# Altium schematic sheet logic.SchDoc
size A4; SheetNumber: 4; SheetTotal: 6
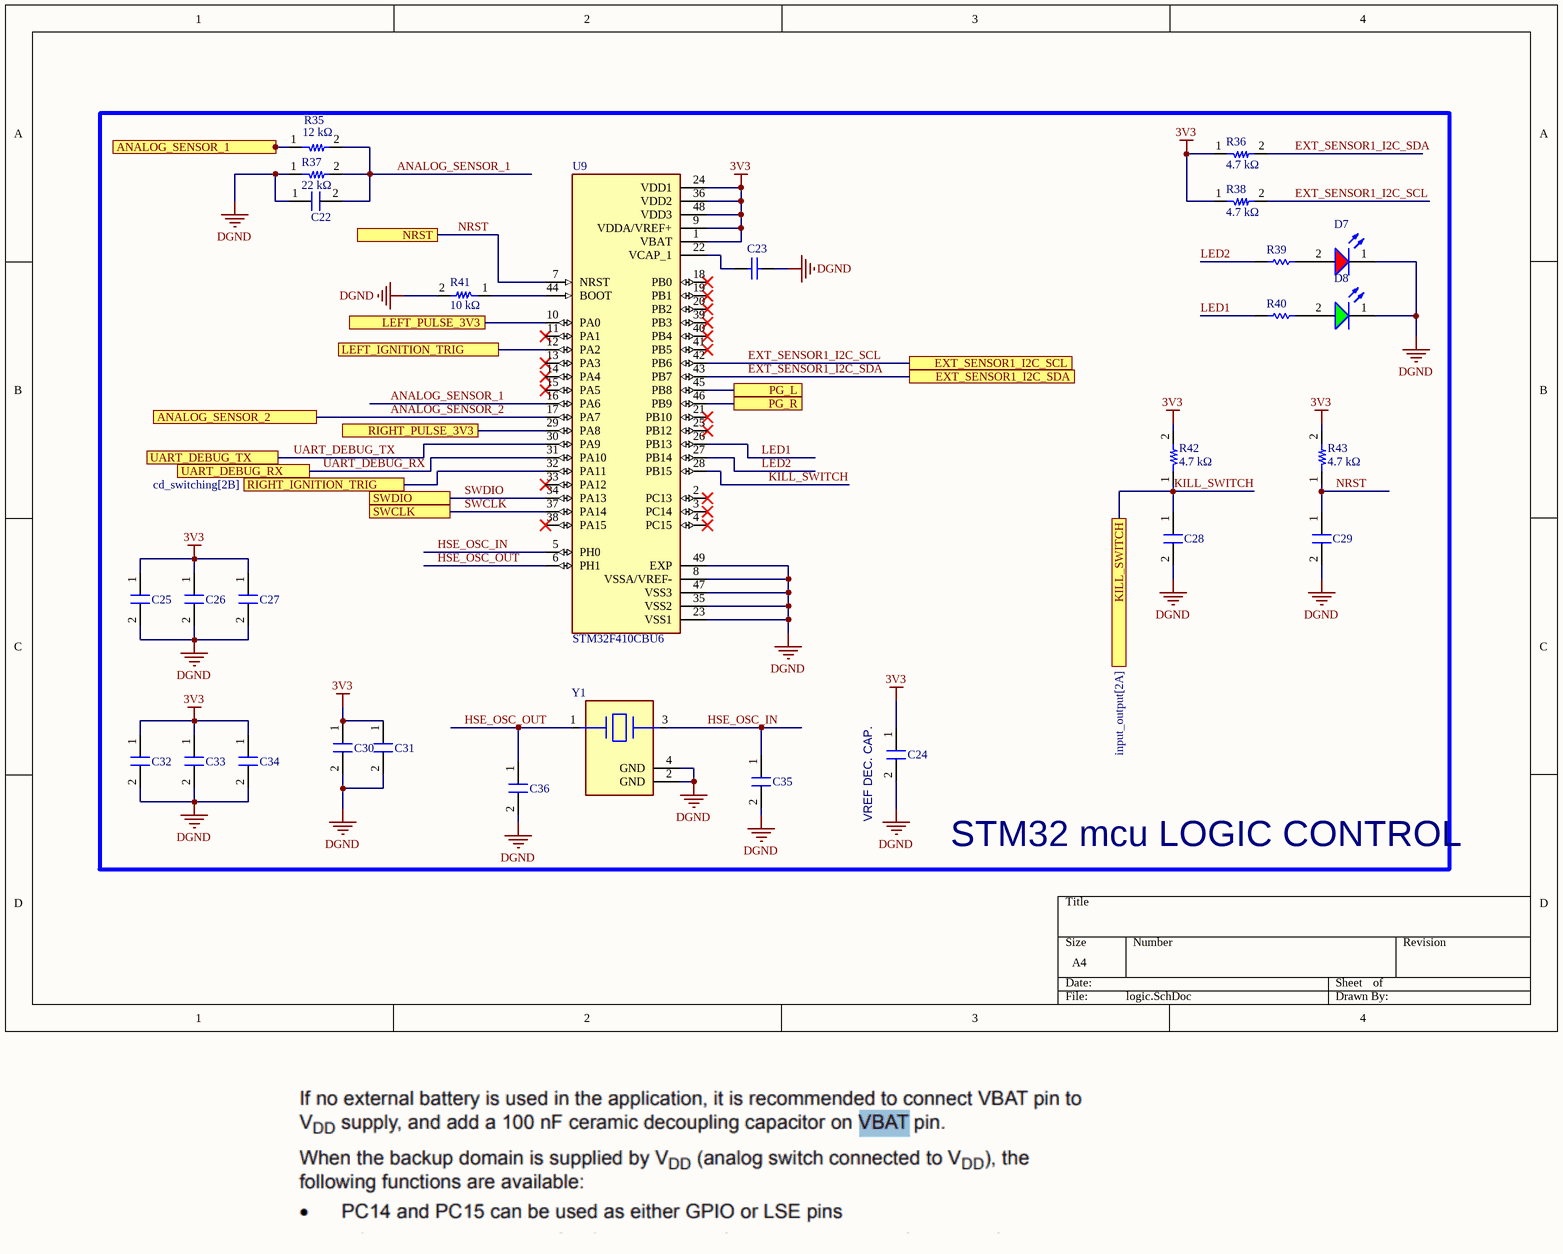
[diagram p0: logic.SchDoc]

## Parts
C22  Capacitor_0402  [0402_fp]  (value not drawn)
C23  0603ZD475MAT2A  [CAPC1608X90X35NL15T15]  (value not drawn)
C24  Capacitor_0402  [0402_fp]  (value not drawn)
C25  Capacitor_0402  [0402_fp]  (value not drawn)
C26  Capacitor_0402  [0402_fp]  (value not drawn)
C27  Capacitor_0402  [0402_fp]  (value not drawn)
C28  Capacitor_0402  [0402_fp]  (value not drawn)
C29  Capacitor_0402  [0402_fp]  (value not drawn)
C30  Capacitor_0402  [0402_fp]  (value not drawn)
C31  Capacitor_0402  [0402_fp]  (value not drawn)
C32  Capacitor_0402  [0402_fp]  (value not drawn)
C33  Capacitor_0402  [0402_fp]  (value not drawn)
C34  Capacitor_0402  [0402_fp]  (value not drawn)
C35  Capacitor_0603  [0603_FP]  (value not drawn)
C36  Capacitor_0603  [0603_FP]  (value not drawn)
D7  150080RS75000  [WL-SMCW_0805_150080xx75000]  (value not drawn)
D8  150080GS75000  [WL-SMCW_0805_150080xx75000]  (value not drawn)
R35  value 12 kΩ  [0402_fp]  (hidden comment: Resistor_0402)
R36  value 4.7 kΩ  [0402_fp]  (hidden comment: Resistor_0402)
R37  value 22 kΩ  [0402_fp]  (hidden comment: Resistor_0402)
R38  value 4.7 kΩ  [0402_fp]  (hidden comment: Resistor_0402)
R39  MCS04020D5600BE100  [RESC1005X37X20NL05T10]  (value not drawn)
R40  MCS04020D5600BE100  [RESC1005X37X20NL05T10]  (value not drawn)
R41  value 10 kΩ  [0402_fp]  (hidden comment: Resistor_0402)
R42  value 4.7 kΩ  [0402_fp]  (hidden comment: Resistor_0402)
R43  value 4.7 kΩ  [0402_fp]  (hidden comment: Resistor_0402)
U9  STM32F410CBU6  [QFN50P700X700X60-49N]
Y1  NX3225GA-16.000M-STD-CRG-2  [FP-NX3225GA-MFG]  (value not drawn)

## Ports
ANALOG_SENSOR_1 (see input_output[1B]), ANALOG_SENSOR_2, EXT_SENSOR1_I2C_SCL (see input_output[1B]), EXT_SENSOR1_I2C_SDA (see input_output[1B]), KILL_SWITCH (see input_output[2A]), LEFT_IGNITION_TRIG (see cd_switching[2B]), LEFT_PULSE_3V3 (see input_signal_conditioning[4B]), NRST (see input_output[3B]), PG_L (see HV_power[4B]), PG_R (see HV_power[4C]), RIGHT_IGNITION_TRIG (see cd_switching[2B]), RIGHT_PULSE_3V3 (see input_signal_conditioning[4B]), SWCLK (see input_output[3A]), SWDIO (see input_output[3A]), UART_DEBUG_RX (see input_output[2B], input_output[3C]), UART_DEBUG_TX (see input_output[2A], input_output[3B])

## Nets
3V3: C24.1 C25.1 C26.1 C27.1 C30.1 C31.1 C32.1 C33.1 C34.1 R36.1 R38.1 R42.2 R43.2 U9.1(VBAT) U9.9(VDDA/VREF+) U9.24(VDD1) U9.36(VDD2) U9.48(VDD3)
DGND: C22.1 C23.2 C24.2 C25.2 C26.2 C27.2 C28.2 C29.2 C30.2 C31.2 C32.2 C33.2 C34.2 C35.2 C36.2 D7.1(K) D8.1(K) R37.1 R41.2 U9.8(VSSA/VREF-) U9.23(VSS1) U9.35(VSS2) U9.47(VSS3) U9.49(EXP) Y1.2(GND) Y1.4(GND)
ANALOG_SENSOR_1: R35.1 ; port ANALOG_SENSOR_1
ANALOG_SENSOR_1: C22.2 R35.2 R37.2 U9.16(PA6)  [a separate net that carries the same name]
ANALOG_SENSOR_2: U9.17(PA7) ; port ANALOG_SENSOR_2
EXT_SENSOR1_I2C_SCL: R38.2 U9.42(PB6) ; port EXT_SENSOR1_I2C_SCL
EXT_SENSOR1_I2C_SDA: R36.2 U9.43(PB7) ; port EXT_SENSOR1_I2C_SDA
HSE_OSC_IN: C35.1 U9.5(PH0) Y1.3
HSE_OSC_OUT: C36.1 U9.6(PH1) Y1.1
KILL_SWITCH: C28.1 R42.1 U9.28(PB15) ; port KILL_SWITCH
LED1: R40.1 U9.26(PB13)
LED2: R39.1 U9.27(PB14)
LEFT_IGNITION_TRIG: U9.12(PA2) ; port LEFT_IGNITION_TRIG
LEFT_PULSE_3V3: U9.10(PA0) ; port LEFT_PULSE_3V3
NRST: C29.1 R43.1 U9.7(NRST) ; port NRST
PG_L: U9.45(PB8) ; port PG_L
PG_R: U9.46(PB9) ; port PG_R
RIGHT_IGNITION_TRIG: U9.32(PA11) ; port RIGHT_IGNITION_TRIG
RIGHT_PULSE_3V3: U9.29(PA8) ; port RIGHT_PULSE_3V3
SWCLK: U9.37(PA14) ; port SWCLK
SWDIO: U9.34(PA13) ; port SWDIO
UART_DEBUG_RX: U9.31(PA10) ; port UART_DEBUG_RX
UART_DEBUG_TX: U9.30(PA9) ; port UART_DEBUG_TX
NetC23_1: C23.1 U9.22(VCAP_1)
NetD7_2: D7.2(A) R39.2
NetD8_2: D8.2(A) R40.2
NetR41_1: R41.1 U9.44(BOOT)

Not connected (* = marked no-connect by the designer): U9 2(PC13)* 3(PC14)* 4(PC15)* 11(PA1)* 13(PA3)* 14(PA4)* 15(PA5)* 18(PB0)* 19(PB1)* 20(PB2)* 21(PB10)* 25(PB12)* 33(PA12)* 38(PA15)* 39(PB3)* 40(PB4)* 41(PB5)*

## Notes on the sheet
- (near C24) VREF DEC. CAP.
- STM32 mcu LOGIC CONTROL

## Library data of the parts
C22 = Capacitor_0402: Value: 1 nF; Format: 0402; Package: 0402
C23 = CMP-1035-02787-2: Manufacturer: AVX Interconnect / Elco; Part Number: 0603ZD475MAT2A
C24 C28 C29 = Capacitor_0402: Value: 100 nF; Format: 0402; Package: 0402
C25-C27 C30-C34 = Capacitor_0402: Value: 10 nF; Format: 0402; Package: 0402
C35 C36 = Capacitor_0603: Value: 10 pF; Format: 0402; Package: 0402
D7 = CMP-1426-00011-3: LED Uni-Color Red 630nm 2-Pin Chip 0805(2012Metric) T/R; Viewing Angle: 140°; Max Junction Temperature (Tj): 95°C; Power Dissipation: 72mW; Forward Current: 100mA; Forward Voltage: 2V; Wavelength: 625nm; Test Current: 20mA; Max Reverse Voltage (DC): 5V; Luminous Intensity: 150mcd; Lens Style: Clear, Rectangular; REACH SVHC: Unknown; Height: 700µm; Case Code (Metric): 2012; Peak Wavelength: 630nm; Length: 2mm; Width: 1.25mm; RoHS: Compliant; Packaging: Tape and Reel; Dominant Wavelength: 625nm; Color: Red; Case Code (Imperial): 0805; Min Operating Temperature: -40°C; Mount: Surface Mount; Max Operating Temperature: 85°C; Case/Package: 0805
D8 = CMP-1426-00007-3: WURTH ELEKTRONIK - 150080GS75000 - LED, Green, SMD, 0805, 30 mA, 3.2 V, 520 nm; Forward Voltage: 3.2V; Viewing Angle: 140°; Power Dissipation: 105mW; Peak Wavelength: 515nm; Max Reverse Voltage (DC): 5V; Luminous Intensity: 450mcd; Wavelength: 525nm; Max Junction Temperature (Tj): 95°C; Forward Current: 100mA; Test Current: 20mA; Lens Style: Clear, Rectangular; Length: 2mm; Case/Package: 0805; Case Code (Metric): 2012; Color: Green; Height: 700µm; Width: 1.25mm; Packaging: Tape and Reel; Mount: Surface Mount; REACH SVHC: Unknown; RoHS: Compliant; Min Operating Temperature: -40°C; Reverse Voltage: 5V; Max Operating Temperature: 85°C; Dominant Wavelength: 525nm; Case Code (Imperial): 0805
R39 R40 = CMP-2002-02518-1: Manufacturer: Vishay BCcomponents; Part Number: MCS04020D5600BE100
U9 = STM32F410CBU6: ARMÂ® CortexÂ®-M4 STM32F4 Microcontroller IC 32-Bit Single-Core 100MHz 128KB (128K x 8) FLASH 48-UFQFPN (7x7); MF: STMicroelectronics; SnapEDA_Link: https://www.snapeda.com/parts/STM32F410CBU6/STMicroelectronics/view-part/?ref=snap; Package: UFQFPN-48 STMicroelectronics; Value: *; MP: STM32F410CBU6; Check_prices: https://www.snapeda.com/parts/STM32F410CBU6/STMicroelectronics/view-part/?ref=eda
Y1 = CMP-200220-000007-1: CRYSTAL 16.0000MHZ 8PF SMD; Frequency Stability: 30ppm; Frequency Tolerance: 20ppm; Frequency: 16MHz; ESR (Equivalent Series Resistance): 80R; Min Operating Temperature: -40°C; Mount: Surface Mount; Width: 0.098inch; Case/Package: SMD/SMT; Max Operating Temperature: 85°C; Number of Pins: 4; Length: 0.126inch; Load Capacitance: 8pF; Packaging: Tape and Reel; Package Quantity: 3000; Height: 0.035inch
R35-R38 R41-R43 = Resistor_0402: Package: 0402